# EasyEDA Pro project ProPrj_BAP PCB General Room_2025-11-06.epro

# Schematic BAP PCB General Room
Board Name: BAP PCB std; Create Date: 2025-11-05; Page Name: Sheet_1; Project Name: BAP PCB General Room; Schematic Name: BAP PCB General Room; Update Date: 2025-11-05; Add into BOM: yes; Company: Your Company; Convert to PCB: yes; Date: 2025-10-31; Draw By: malkk44.mf; REV: 1.0; Sheet: 1/1; spicePre: .
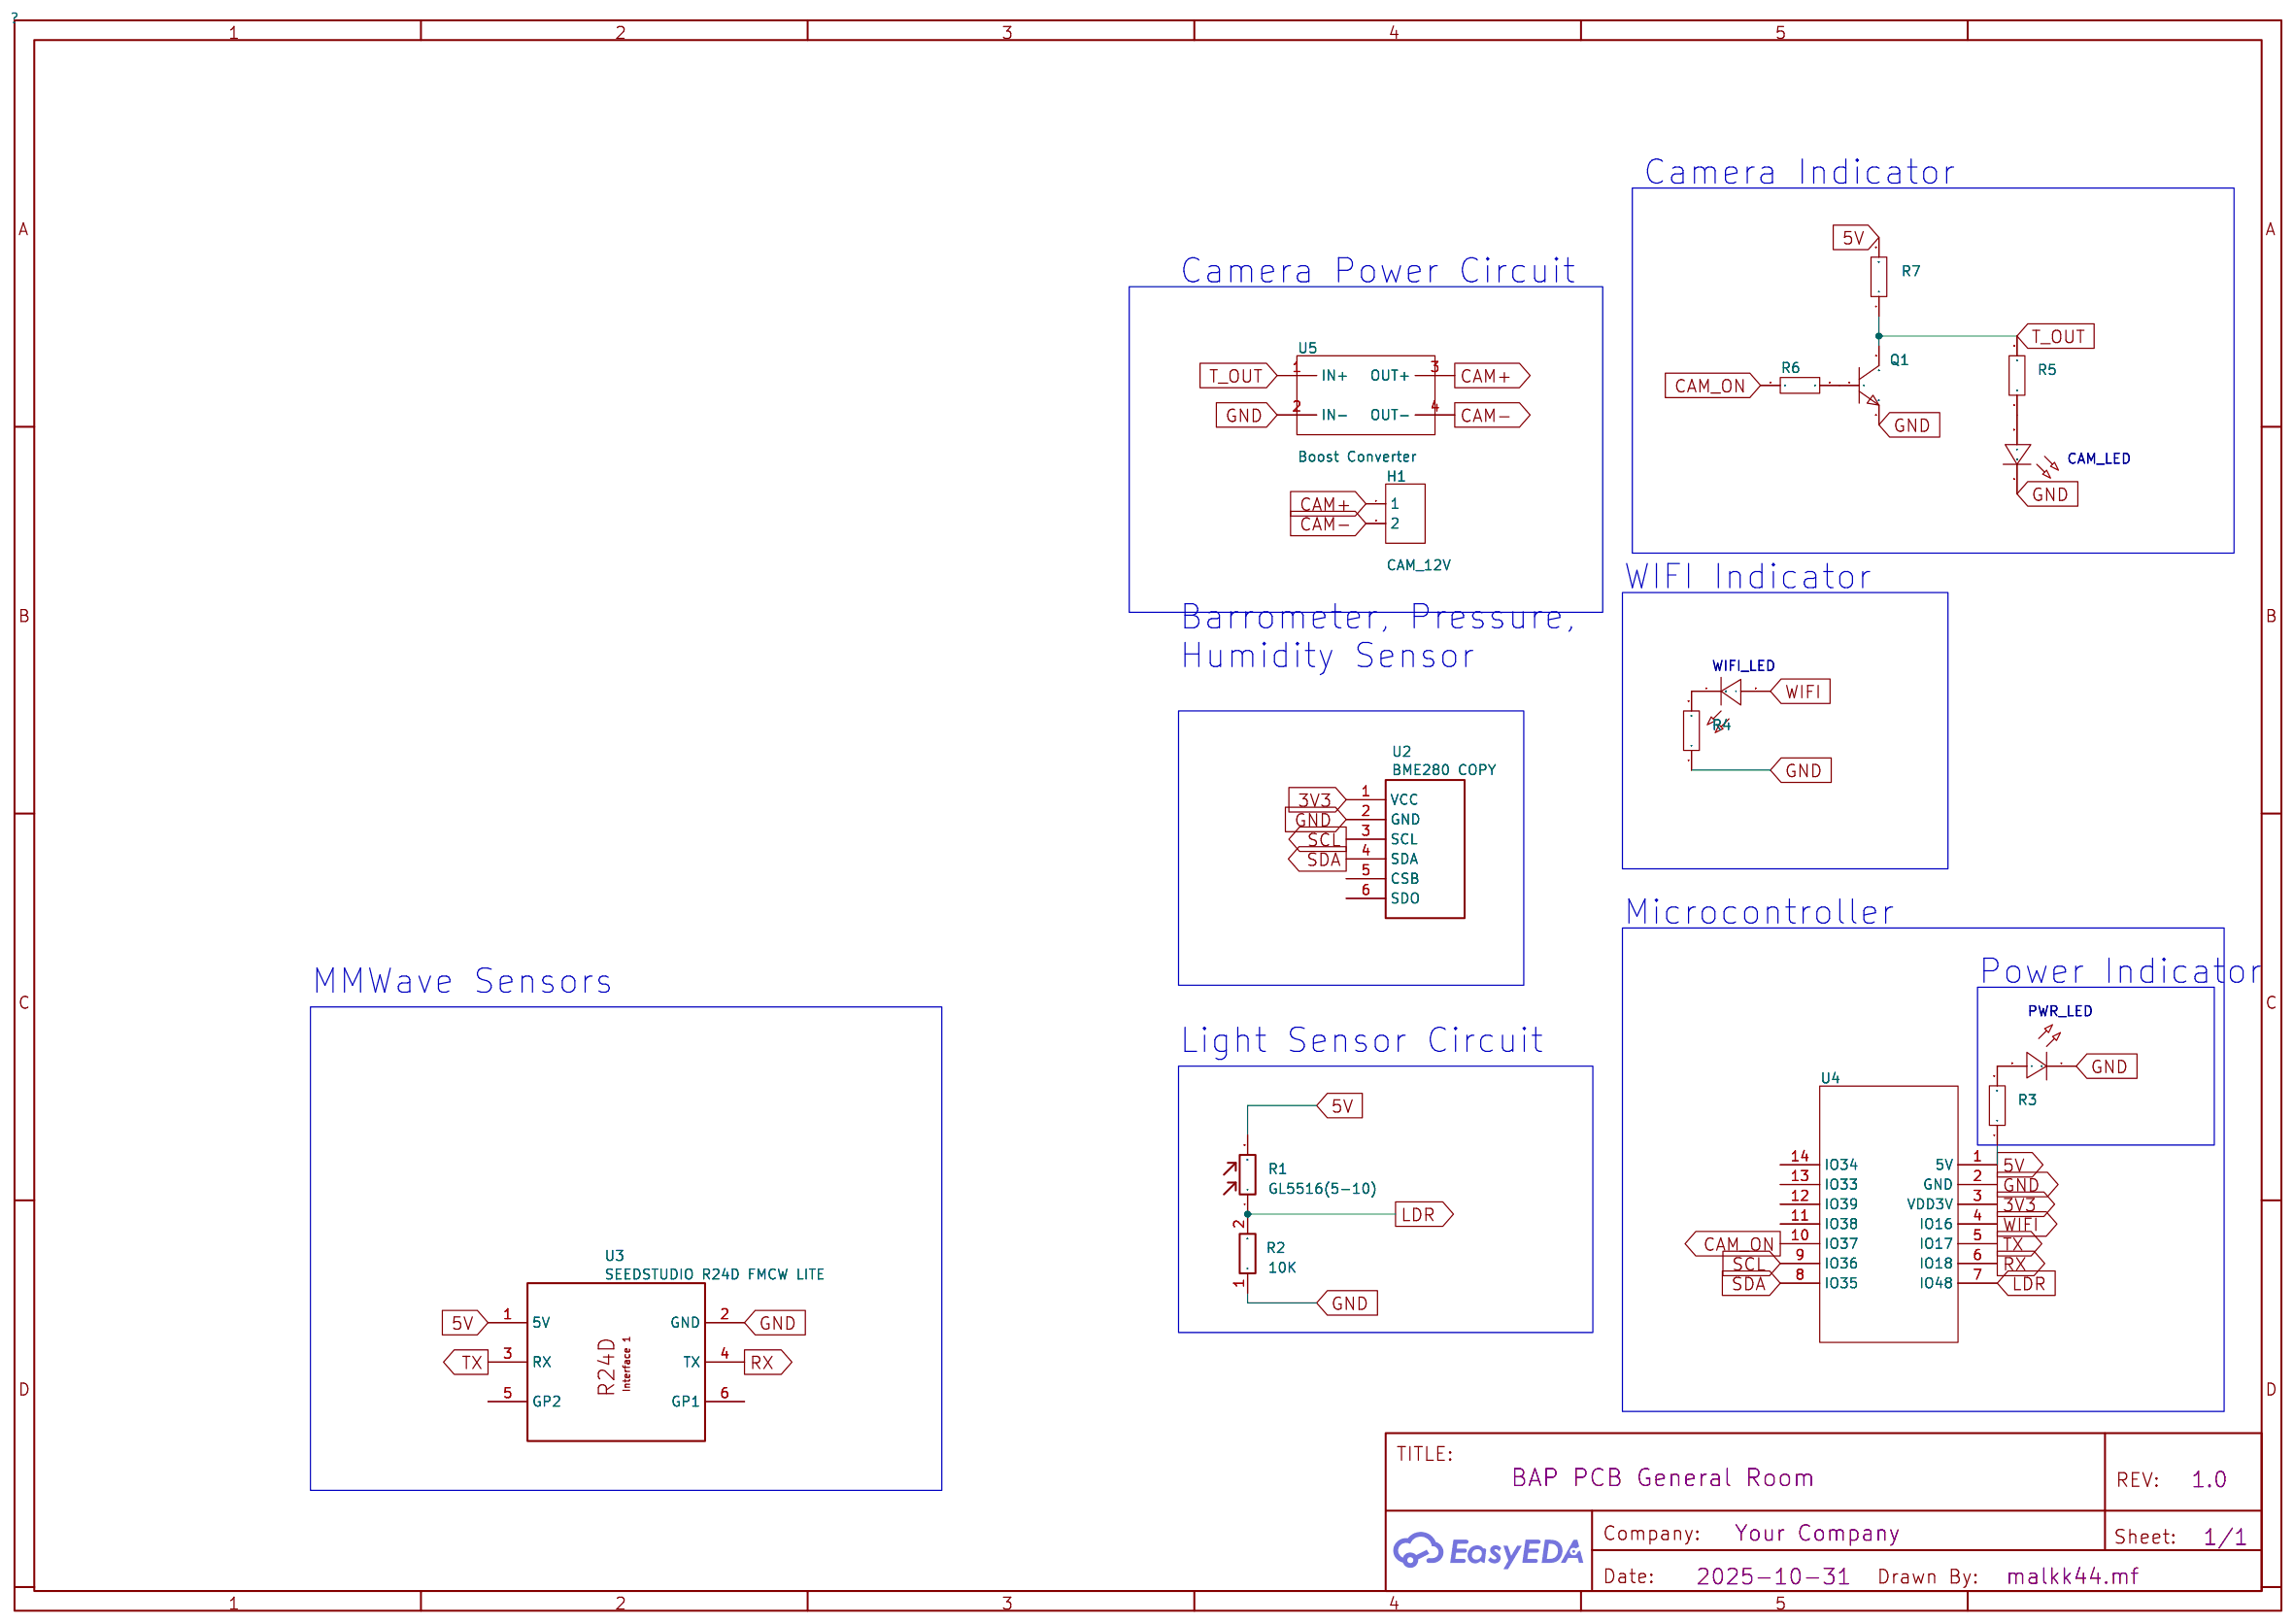
[diagram p0: schematic sheet]

## Parts
CAM_LED  -  [LED_0603]
H1  CAM_12V  [HDR-TH_2P-P2.54-V-F]
PWR_LED  -  [LED_0603]
Q1  -  [S8050_SOT-23]
R1  GL5516(5-10)  [GL5516]
R2  10K  [RES_10KOHM]
R3  330Ω  [RES-TH_BD2.2-L6.5-P10.50-D0.6]
R4  330Ω  [RES-TH_BD2.2-L6.5-P10.50-D0.6]
R5  330Ω  [RES-TH_BD2.2-L6.5-P10.50-D0.6]
R6  -  [Resistor 1/8w 7mm metal film]
R7  -  [Resistor 1/8w 7mm metal film]
U2  BME280 COPY  [BME280:BME280-Module]
U3  SEEDSTUDIO R24D FMCW LITE  [R24D]
U4  -  [LilyGO TQ-T Pro]
U5  Boost Converter  [Boost Converter]
WIFI_LED  -  [LED_0603]

## Library data of the parts
CAM_LED PWR_LED WIFI_LED = LED_0603-G: Supplier Footprint: 0603
H1 = HDR-F_2.54_1x2P: Holes Structure:1x2P Pitch:2.54mm Row Spacing:- Mounting Type:Straight Number of Rows:Plugin Number of Holes:2P Insulation Height:- Contact Material:- Contact Plating:-; Supplier Part: C49661; Supplier Footprint: 插件; Holes Structure: 1x2P; Pitch: 2.54mm; Mounting Type: Straight; Number of Rows: Plugin; Number of Holes: 2P
Q1 = S8050_SOT_NPN: Supplier Footprint: SOT-23
R1 = GL5516(5-10): Supplier: LCSC; Manufacturer: JCHL(晶创和立); Supplier Part: C10077; JLCPCB Part Class: Extended Part; spicePre: R
R2 = 10K: Supplier: LCSC; Supplier Part: C119313; Manufacturer: CCO(千志电子); Manufacturer Part: MF1/4W-330Ω±1% T; JLCPCB Part Class: Extended Part; nameAlias: Value; Contributor: LCSC; spicePre: R; spiceSymbolName: 10K-R-THT
R3-R5 = MFR-25FTE52-330R: Type:Metal Film Resistors Resistance: Tolerance:±1% Tolerance:±1% Power(Watts):250mW Temperature Coefficient:±50ppm/℃ Temperature Coefficient:±50ppm/℃; LCSC Part Name: 330Ω ±1% 250mW; Supplier Part: C138208; Manufacturer: YAGEO(国巨); Supplier Footprint: 轴向引线; JLCPCB Part Class: Extended Part; Datasheet: https://atta.szlcsc.com/upload/public/pdf/source/20171107/C138208_15100517551321097101.pdf; Supplier: LCSC; Type: Metal Film Resistors; Tolerance: ±1%; Power(Watts): 250mW; Temperature Coefficient: ±50ppm/℃
R6 R7 = resistor: Supplier: LCSC; Manufacturer: UNI-ROYAL(Uniroyal Elec); Manufacturer Part: 1206W4F1002T5E; Supplier Part: C17902; Resistance: 10KΩ; JLCPCB Part Class: Basic Part; Datasheet: https://datasheet.lcsc.com/lcsc/2206010145_UNI-ROYAL-Uniroyal-Elec-1206W4F1002T5E_C17902.pdf
U2 = BME280 COPY: Manufacturer Part: BME280; Contributor: b_amnart; sourceId: RIigQOMlj; spicePre: U
U3 = SEEDSTUDIO R24D FMCW LITE: Supplier: Seeed Studio; Supplier Part: 101991030; link: https://www.seeedstudio.com/24GHz-mmWave-Sensor-Human-Static-Presence-Module-Lite-p-5524.html; Contributor: hutzomene; spicePre: U
U4 = LilyGO TQ-T Pro
U5 = Boost Converter

## Nets
3V3: U2.1(VCC) U4.3(VDD3V)
5V: R1.2 R3.1 R7.2 U3.1(5V) U4.1(5V)
GND: CAM_LED.1(C) PWR_LED.1(C) Q1.2 R2.1 R4.1 U2.2(GND) U3.2(GND) U4.2(GND) U5.2(IN-)
CAM+: H1.1 U5.3(OUT+)
CAM-: H1.2 U5.4(OUT-)
CAM_ON: R6.1 U4.10(IO37)
LDR: R1.1 R2.2 U4.7(IO48)
RX: U3.4(TX) U4.6(IO18)
SCL: U2.3(SCL) U4.9(IO36)
SDA: U2.4(SDA) U4.8(IO35)
T_OUT: Q1.3 R5.2 R7.1 U5.1(IN+)
TX: U3.3(RX) U4.5(IO17)
WIFI: U4.4(IO16) WIFI_LED.2(A)
$1N1519: PWR_LED.2(A) R3.2
$1N2330: R4.2 WIFI_LED.1(C)
$1N2503: CAM_LED.2(A) R5.1
$1N3824: Q1.1 R6.2

Not connected (* = marked no-connect by the designer): U2 5(CSB) 6(SDO); U3 5(GP2) 6(GP1); U4 11(IO38) 12(IO39) 13(IO33) 14(IO34)

## Notes on the sheet
- Camera Indicator
- Camera Power Circuit
- WIFI Indicator
- Barrometer, Pressure,
  Humidity Sensor
- Microcontroller
- Power Indicator
- MMWave Sensors
- Light Sensor Circuit

# Board PCB General Room
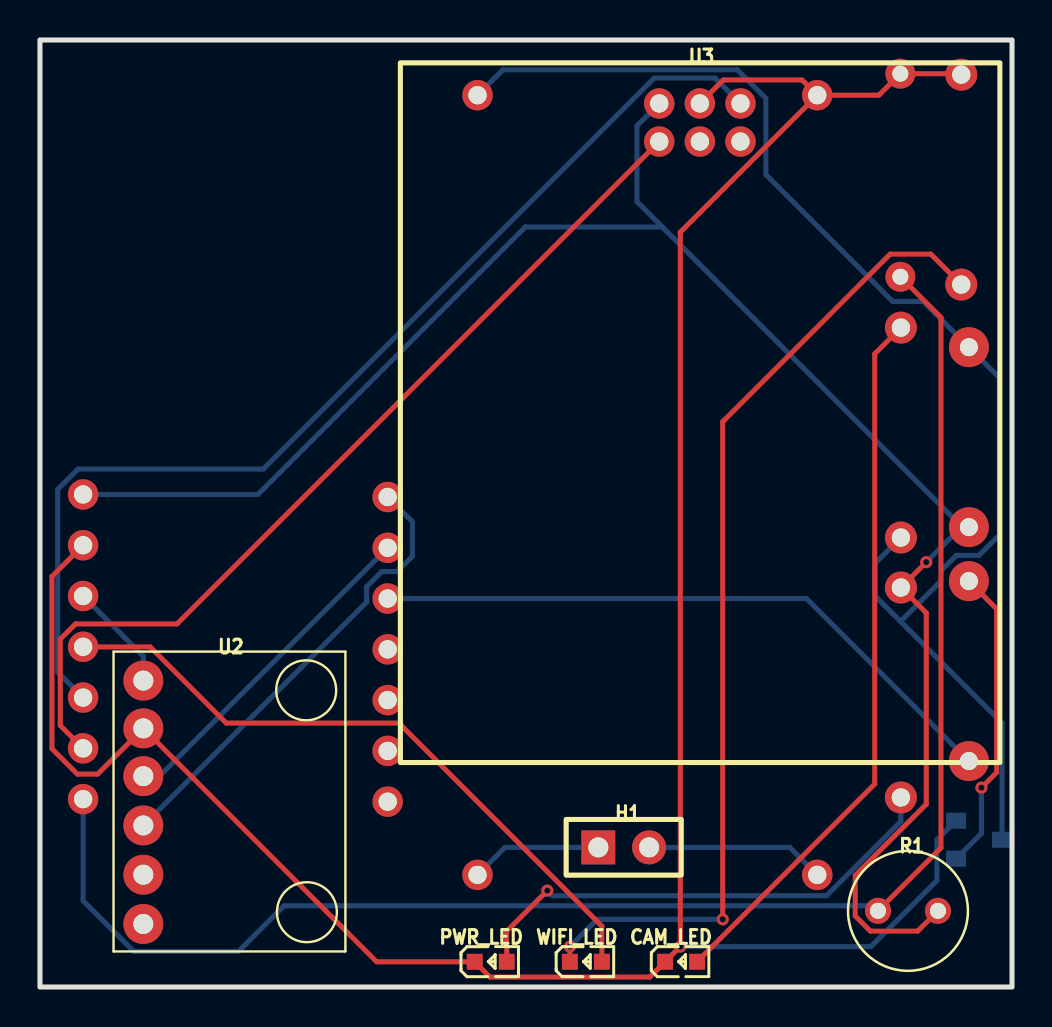
[diagram p1: board, top side]
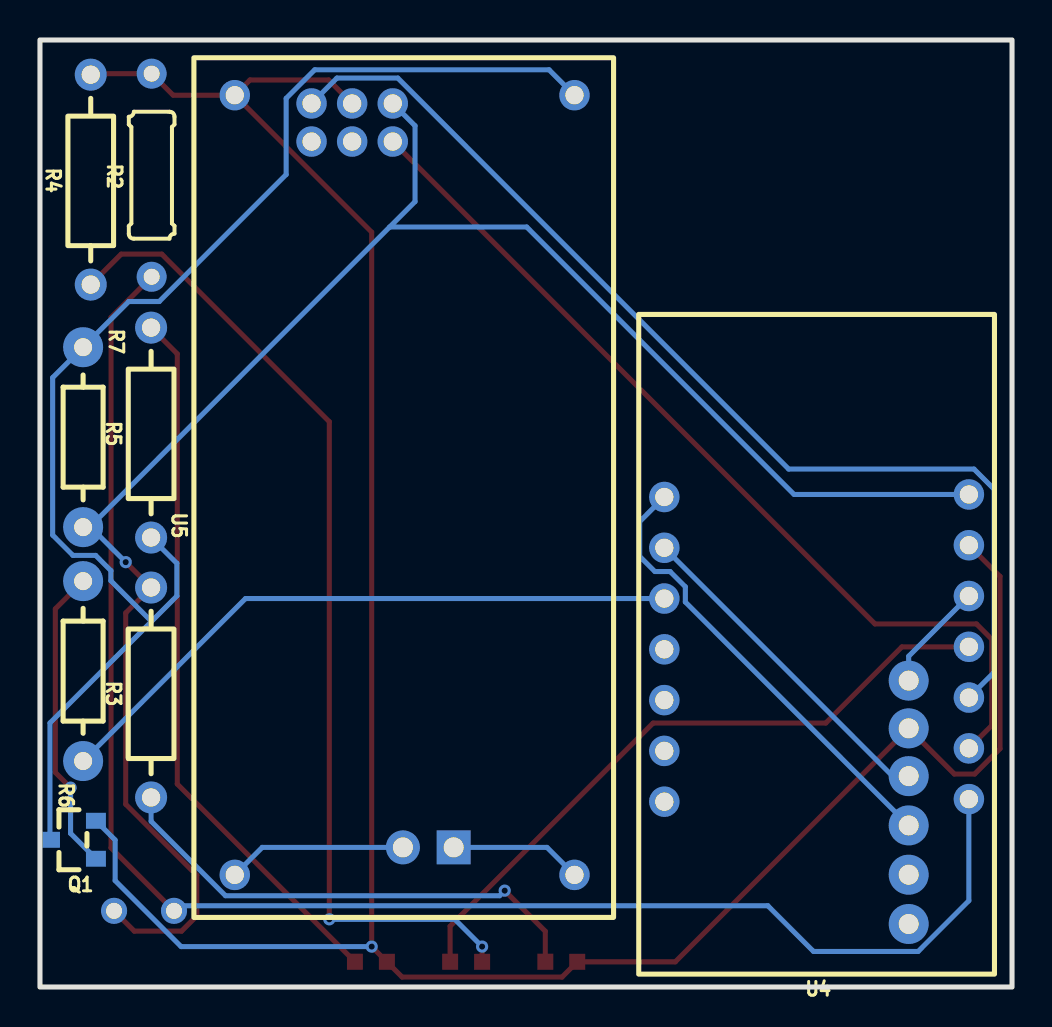
[diagram p2: board, bottom side, seen from below]

Outline 48.64 x 47.37 mm; copper layers: Top Layer, Bottom Layer. Coordinates in mm from the lower left corner of the outline.
Outline path: rectangle 0,47.37 48.64,0
Stack: Top Layer 0.035mm / Dielectric1 1.51mm FR4 er 4.5 / Bottom Layer 0.035mm

## Design rules (mm)
template: JLCPCB Capability(Two Layers Board)
spacing copperThickness1oz (default): track to track 0.102, other pairs 0.152 to 0.3
spacing copperThickness2oz: track to track 0.203, other pairs 0.152 to 0.3
track width copperThickness1oz (default): min 0.127, default 0.254, max 2.54
track width copperThickness2oz: min 0.203, default 0.254, max 2.54
differential pair differentialPair (default): width min 0.127, default 0.254, max 2.54; gap min 0.152, default 0.152
via viaSize (default): diameter min 0.5, default 0.61, max 10; hole min 0.3, default 0.305, max 6.3

## Placement (name value [footprint] x y rotation side)
CAM_LED  -  [LED_0603]  32.13 1.27 0 top
H1  CAM_12V  [HDR-TH_2P-P2.54-V-F]  29.21 6.98 0 top
PWR_LED  -  [LED_0603]  22.61 1.27 0 top
Q1  -  [S8050_SOT-23]  46.99 7.24 180 bottom
R1  GL5516(5-10)  [GL5516]  43.43 3.81 0 top
R2  10K  [RES_10KOHM]  43.05 40.61 270 bottom
R3  330Ω  [RES-TH_BD2.2-L6.5-P10.50-D0.6]  43.08 14.73 270 bottom
R4  330Ω  [RES-TH_BD2.2-L6.5-P10.50-D0.6]  46.1 40.39 270 bottom
R5  330Ω  [RES-TH_BD2.2-L6.5-P10.50-D0.6]  43.08 27.73 270 bottom
R6  -  [Resistor 1/8w 7mm metal film]  46.48 11.3 90 bottom
R7  -  [Resistor 1/8w 7mm metal film]  46.48 32 270 bottom
U2  BME280 COPY  [BME280:BME280-Module]  3.68 1.78 0 top
U3  SEEDSTUDIO R24D FMCW LITE  [R24D]  18.03 46.23 0 top
U4  -  [LilyGO TQ-T Pro]  9.78 17.14 180 bottom
U5  -  [Boost Converter]  40.89 46.61 270 bottom
WIFI_LED  -  [LED_0603]  27.37 1.27 0 top

## Footprints (pads in the part's own frame, mm; a bottom-side part is the same pattern mirrored in y, then rotated)
BME280:BME280-Module
  round 2 hole 1: 1(1.489,13.549) 2(1.489,11.16) 3(1.489,8.77) 4(1.489,6.305) 5(1.489,3.84) 6(1.489,1.375)
Boost Converter
  round 1.524 hole 0.914: 1(2,19) 2(2,2) 3(41,19) 4(41,2)
GL5516
  round 1.308 hole 0.8: 1(-1.5,0) 2(1.5,0)
HDR-TH_2P-P2.54-V-F
  rect 1.7x1.7 hole 1: 1(-1.27,0)
  round 1.7 hole 1: 2(1.27,0)
LED_0603
  rect 0.8x0.8 smd: 1(-0.851,-0.01) 2(0.75,-0.005)
LilyGO TQ-T Pro
  round 1.524 hole 0.914: 1(7.62,7.493) 2(7.62,4.953) 3(7.62,2.413) 4(7.62,-0.127) 5(7.62,-2.667) 6(7.62,-5.207) 7(7.62,-7.747) 8(-7.62,7.366) 9(-7.62,4.826) 10(-7.62,2.286) 11(-7.62,-0.254) 12(-7.62,-2.794) 13(-7.62,-5.334) 14(-7.62,-7.874)
R24D
  round 1.524 hole 0.914: 1(12.954,-2.032) 2(14.986,-2.032) 3(17.018,-2.032) 4(12.954,-3.937) 5(14.986,-3.937) 6(17.018,-3.937)
RES-TH_BD2.2-L6.5-P10.50-D0.6
  round 1.6 hole 0.914: 1(-5.25,0) 2(5.25,0)
RES_10KOHM
  round 1.5 hole 0.8: 1(-5.08,0) 2(5.08,0)
Resistor 1/8w 7mm metal film
  round 2 hole 0.9: 1(0,0) 2(9,0)
S8050_SOT-23
  rect 1x0.8 smd: 1(1.15,-0.823) 2(1.15,1.077) 3(-1.15,0.127)

## Nets
As in the schematic.

Pads without a net: U2 5 6; U3 5 6; U4 11 12 13 14

## Via types
v1: diameter 0.61, hole 0.305, Top Layer to Bottom Layer, 6 vias

## Routing (per net, layer and track width the routed paths; a pad name or vN(x,y) marks a point on that pad's centre or on a via; arc(x,y) is an arc through that point)
3V3: length 5.5
  Bottom Layer w0.254: U2.1 5.17,16.55 U4.3
5V: length 90.9
  Top Layer w0.254: v1(44.35,21.25) R3.1 44.35,18.71 44.35,9.14 40.79,5.59 40.79,3.56 41.56,2.79 43.92,2.79 R1.2
  Bottom Layer w0.254: U3.1 29.87,43.08 29.87,39.29 31.14,38.02 ; 46.13,23.03 46.46,23.03 R7.2 ; 46.13,23.03 v1(44.35,21.25) ; 46.13,23.03 31.14,38.02 ; 31.14,38.02 24.28,38.02 10.91,24.64 U4.1
GND: length 126.9
  Top Layer w0.254: U5.2 41.98,44.61 R2.1 46.05,45.69 R4.1 ; U5.2 32.04,37.76 v1(32.04,2.02) CAM_LED.1 30.52,0.5 22.52,0.5 PWR_LED.1 16.85,1.26 U2.2 2.89,10.65 1.87,10.65 0.6,11.92 0.6,20.54 U4.2 ; U5.2 38.13,45.37 34.2,45.37 U3.2
  Bottom Layer w0.254: 45.84,8.32 44.88,7.36 44.88,5.32 41.58,2.02 v1(32.04,2.02)
CAM+: length 6.6
  Bottom Layer w0.254: U5.3 23.27,6.98 27.94,6.98
CAM-: length 9
  Bottom Layer w0.254: U5.4 37.52,6.98 H1.2
CAM_ON: length 32.4
  Bottom Layer w0.254: U4.10 38.35,19.43 R6.1
LDR: length 80.8
  Top Layer w0.254: R1.1 45.08,6.96 45.08,33.49 R2.2
  Bottom Layer w0.254: U4.7 2.16,4.32 4.7,1.78 9.93,1.78 12.22,4.06 41.68,4.06 R1.1
RX: length 46.2
  Top Layer w0.254: U3.4 6.86,18.16 1.78,18.16 1.02,17.4 1.02,13.08 U4.6
SCL: length 17
  Bottom Layer w0.254: U4.9 5.98,10.55 U2.3
SDA: length 23
  Bottom Layer w0.254: U4.8 18.63,23.28 18.63,21.55 17.87,20.78 17.11,20.78 16.35,20.02 16.35,19.26 U2.4
T_OUT: length 68.4
  Bottom Layer w0.254: 43.06,18.29 45.09,20.32 45.09,20.83 45.85,21.59 46.99,21.59 48.01,22.61 48.01,30.48 R7.1 44.2,34.29 42.67,34.29 36.32,40.64 36.32,44.45 34.89,45.88 23.16,45.88 U5.1 ; 43.06,18.29 41.79,19.56 41.79,21.19 R5.2 ; 43.06,18.29 48.14,13.21 48.14,7.37
TX: length 54.2
  Bottom Layer w0.254: U4.5 0.89,15.75 0.89,24.89 1.91,25.91 11.18,25.91 30.73,45.47 33.78,45.47 U3.3
WIFI: length 33.5
  Top Layer w0.254: WIFI_LED.2 28.12,3.04 17.96,13.2 9.32,13.2 5.51,17.01 2.16,17.01
$1N1519: length 24.9
  Top Layer w0.254: v1(25.39,4.82) 23.36,2.79 PWR_LED.2
  Bottom Layer w0.254: R3.2 43.08,8.29 39.36,4.57 25.64,4.57 v1(25.39,4.82)
$1N2330: length 49.9
  Top Layer w0.254: v1(34.16,3.39) 34.16,28.28 42.55,36.66 44.58,36.66 R4.2 ; v1(26.52,2.02) WIFI_LED.1
  Bottom Layer w0.254: v1(34.16,3.39) 27.88,3.39 v1(26.52,2.02)
$1N2503: length 35.9
  Top Layer w0.254: CAM_LED.2 41.77,10.16 41.77,31.67 R5.1
$1N3824: length 15.3
  Top Layer w0.254: R6.2 47.87,18.91 47.87,10.73 v1(47.11,9.97)
  Bottom Layer w0.254: 45.84,6.42 47.11,7.69 v1(47.11,9.97)
